# EAGLE design SPV1040 v1.0 (EAGLE 7.7.0)
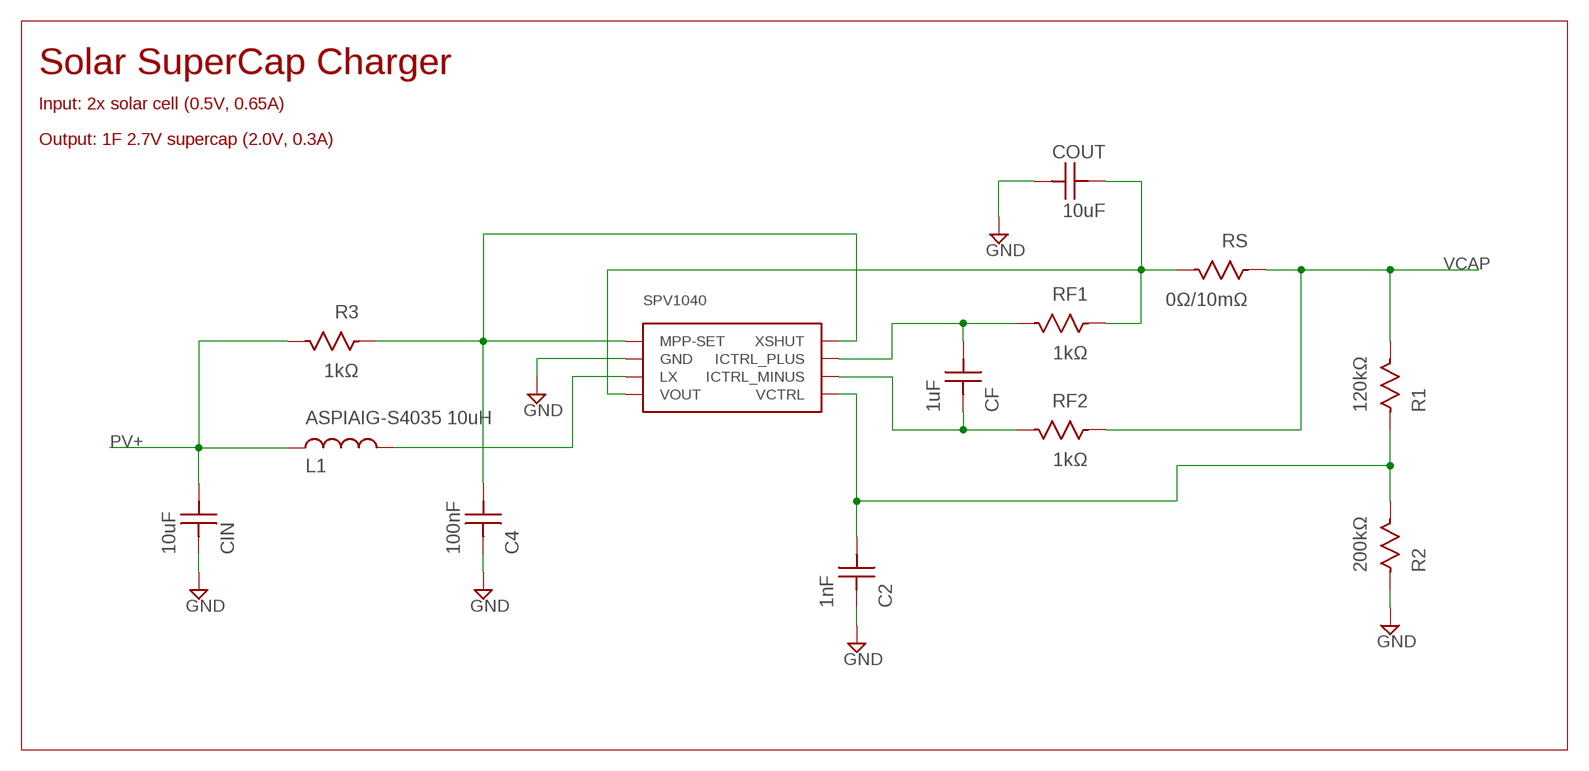
[diagram p0: schematic, sheet 1]

## Parts
C2  1nF  CAP0402  [CAP0402]
C4  100nF  CAP0402  [CAP0402]
CF  1uF  CAP0402  [CAP0402]
CIN  10uF  CAP0402  [CAP0402]
COUT  10uF  CAP0402  [CAP0402]
L1  ASPIAIG-S4035 10uH  ASPIAIG-S4035  [ASPIAIG-S4035]
R1  120kΩ  RES0402  [RES0402]
R2  200kΩ  RES0402  [RES0402]
R3  1kΩ  RES0402  [RES0402]
RF1  1kΩ  RES0402  [RES0402]
RF2  1kΩ  RES0402  [RES0402]
RS  0Ω/10mΩ  RES0402  [RES0402]
U1  SPV1040  [SPV1040]

## Nets
GND: C2.P$1 C4.P$1 CIN.P$1 COUT.P$2 R2.P$1 U1.GND
N11: C4.P$2 R3.P$1 U1.MPP-SET U1.XSHUT
N$2: CF.P$2 RF1.P$2 U1.ICTRL_PLUS
N$3: CF.P$1 RF2.P$2 U1.ICTRL_MINUS
N$4: COUT.P$1 RF1.P$1 RS.P$2 U1.VOUT
N$7: C2.P$2 R1.P$1 R2.P$2 U1.VCTRL
N$8: L1.P$2 U1.LX
PV+: CIN.P$2 L1.P$1 R3.P$2
VCAP: R1.P$2 RF2.P$1 RS.P$1

## Notes on the sheet
- Solar SuperCap Charger
- Input: 2x solar cell (0.5V, 0.65A)
- Output: 1F 2.7V supercap (2.0V, 0.3A)

## Library data of the parts
C2 C4 CF CIN COUT = TT7:CAP0402: CAPACITOR 0402 - 1 x 0.5 x 0.35mm
L1 = TT7:ASPIAIG-S4035: ASPIAIG-S4035 10uH inductor.
R1-R3 RF1 RF2 RS = TT7:RES0402: RESISTOR 0402 - 1 x 0.5 x 0.35mm
U1 = TT7:SPV1040: SPV1040 high efficiency solar battery charger with embedded MPPT in a TSSOP8 package.

## Board
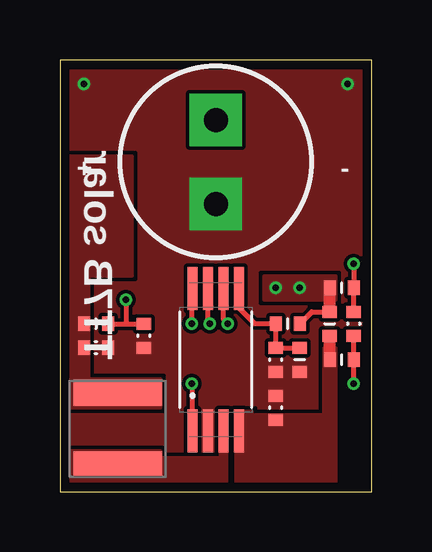
[diagram p1: board, top side]
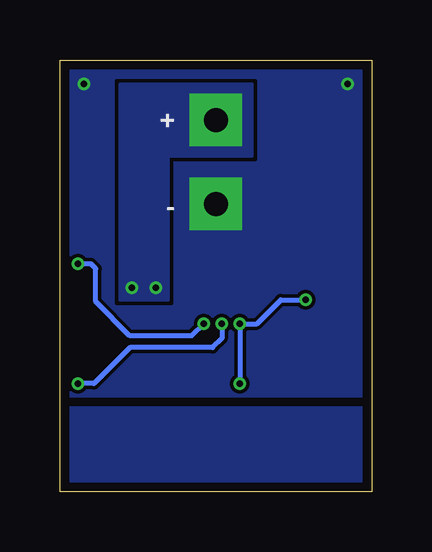
[diagram p2: board, bottom side, seen from below]

Size 13 x 18 mm. Coordinates in mm from the lower left corner, seen from the top.
Outline: 0,0 13,0 13,18 0,18 0,0
Copper layers (1*16): Top 0.035559375mm / dielectric 1.6mm / Bottom 0.035559375mm
Design rules "oshpark-2layer *": minimum track width 6mil, minimum drill 10mil, track to track 6mil, track to pad 6mil, pad to pad 6mil, via to via 6mil, smd to smd 6mil, copper to edge 15mil, drill to drill 6mil, minimum pad ring 5mil, minimum via ring 5mil, stop-mask expansion 2.5mil, vias tented up to drill 20mil, thermal gap 10mil

### Footprints (pad centres in the part's own frame; a part is rotated, then mirrored left to right if it is on the bottom)
CAP0402 = smd 0.5 x 0.6: P$1 -0.5,0; P$2 0.5,0
ASPIAIG-S4035 = smd 1.1 x 3.7: P$1 -1.5,0; P$2 1.5,0
RES0402 = smd 0.5 x 0.6: P$1 -0.5,0; P$2 0.5,0
SPV1040 = smd 1.78 x 0.42: GND -2.97,0.325; ICTRL_MINUS 2.97,-0.325; ICTRL_PLUS 2.97,0.325; LX -2.97,-0.325; MPP-SET -2.97,0.975; VCTRL 2.97,-0.975; VOUT -2.97,-0.975; XSHUT 2.97,0.975

### Placement (x,y rotation side)
C2  9,5.5 90 top
C4  3.5,6.5 90 top
CF  12.25,7 270 top
CIN  1.5,6 180 top
COUT  9,3.5 90 top
L1  2.42,2.62 270 top
R1  9.5,7 0 top
R2  10,5.5 90 top
R3  1.5,7 180 top
RF1  11.75,5.5 0 top
RF2  11.75,8.5 0 top
RS  11.25,7 270 top
U1  6.5,5.5 90 top

### Tracks (layer width: path | path; a pad name or v marks a point on that pad's centre or on a via)
GND  (via drill 0.25, 1 pad 2.18)
  other vias: 12,17 6.5,12 1,17
  pour Bottom (rank 2, no thermals): 0,4 0,18 13,18 13,4
  pour Top (rank 2, no thermals): 0,18 13,18 13,0 0,0
N11  (via drill 0.25)
  Top 0.2: R3.P$1 2.75,7 | 2.75,7 C4.P$2 | v2.75,8 2.75,7 | v5.5,7 5.5,8.47 U1.XSHUT | v5.5,4.5 5.5,2.53 U1.MPP-SET
  Bottom 0.2: v2.75,8 3.79,8 4.79,7 v5.5,7 v5.5,4.5
N$1
  pour Bottom (rank 2): 0,3.5 13,3.5 13,0 0,0
N$2  (via drill 0.25)
  Top 0.2: v12.25,4.5 RF1.P$2 CF.P$2 | v6.25,7 6.17,7.08 U1.ICTRL_PLUS
  Bottom 0.2: v6.25,7 6.25,6.38 6.63,6 10.07,6 11.57,4.5 v12.25,4.5
N$3  (via drill 0.25)
  Top 0.2: v12.25,9.5 RF2.P$2 CF.P$1 | v7,7 6.83,7.17 U1.ICTRL_MINUS
  Bottom 0.2: v7,7 7.5,6.5 10.09,6.5 11.51,7.92 11.51,9.3 11.71,9.5 v12.25,9.5 | v12.25,9.5
N$4
  Top 0.5: RF1.P$1 RS.P$2
  pour Top (no thermals): 11,6 11.5,6 11.5,0 7.35,0 7.35,3.35 8,3.35 8,3.2 11,3.2
N$7
  Top 0.2: R2.P$2 C2.P$2 R1.P$1 8.13,7 7.47,7.66 U1.VCTRL
N$8
  pour Top (no thermals): 0,1.7 4.2,1.7 4.2,1.4 6.7,1.4 6.7,2 6.95,2 6.95,0 0,0
PV+
  pour Top (no thermals): 4.2,3.5 4.2,4.7 1.2,4.7 1.2,9 3,9 3,14 0,14 0,3.5
VCAP  (via drill 0.25, 1 pad 2.18)
  Top 0.2: R1.P$2 10.5,7.5 RS.P$1
  Top 0.5: RS.P$1 RF2.P$1
  other vias: 6.5,15.5 9,8.5 10,8.5
  pour Top (no thermals): 8.5,9 11.5,9 11.5,8 8.5,8
  pour Bottom (no thermals): 8.5,8 10.5,8 10.5,17 5,17 5,14 8.5,14

### Text on the board
tPlace: + | - | TT7B solar
bPlace: + | -